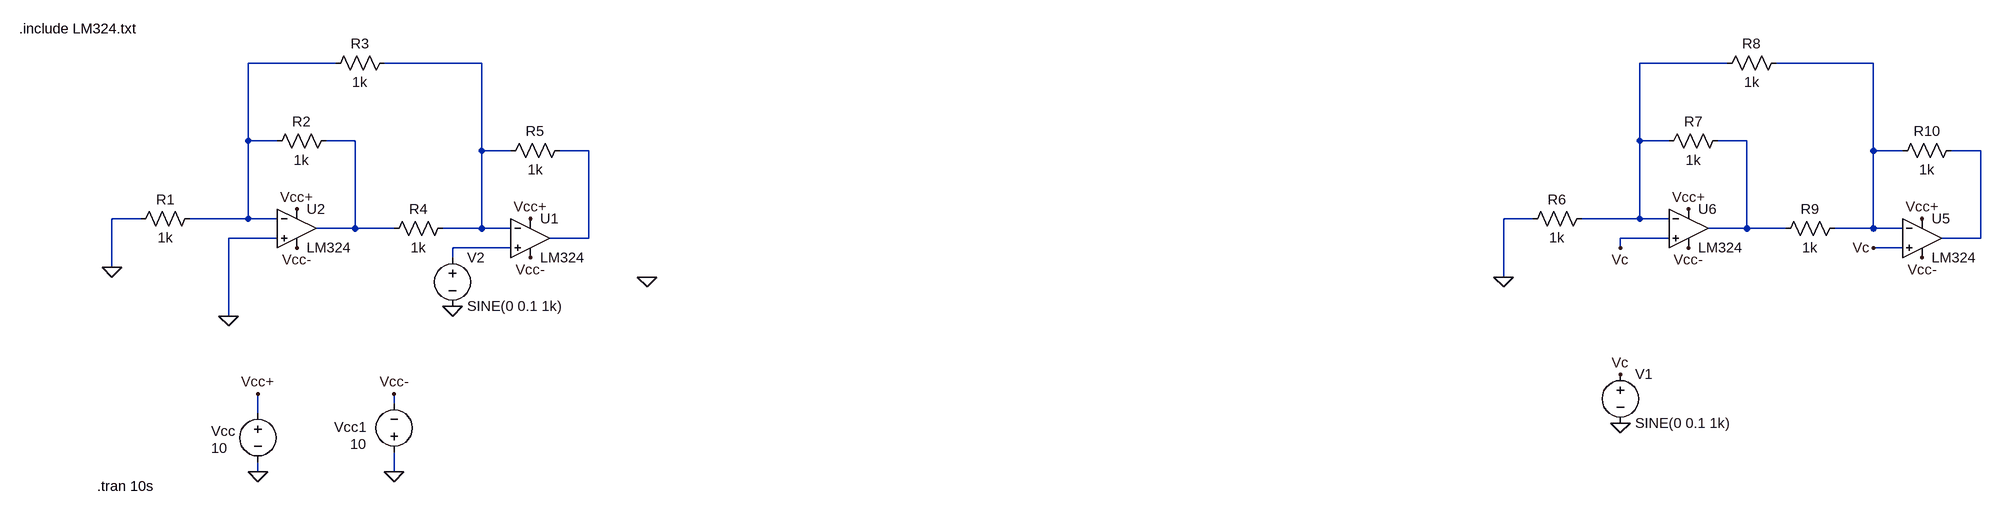
[diagram p0: schematic Circuito_1.asc]
Circuito_1.asc, the LTspice schematic file:
Version 4
SHEET 1 2772 888
WIRE 64 112 -80 112
WIRE 304 112 144 112
WIRE 2352 112 2208 112
WIRE 2592 112 2432 112
WIRE -80 240 -80 112
WIRE -32 240 -80 240
WIRE 96 240 48 240
WIRE 2208 240 2208 112
WIRE 2256 240 2208 240
WIRE 2384 240 2336 240
WIRE 304 256 304 112
WIRE 352 256 304 256
WIRE 480 256 432 256
WIRE 2592 256 2592 112
WIRE 2640 256 2592 256
WIRE 2768 256 2720 256
WIRE -256 368 -304 368
WIRE -80 368 -80 240
WIRE -80 368 -176 368
WIRE -32 368 -80 368
WIRE 2032 368 1984 368
WIRE 2208 368 2208 240
WIRE 2208 368 2112 368
WIRE 2256 368 2208 368
WIRE 96 384 96 240
WIRE 96 384 32 384
WIRE 160 384 96 384
WIRE 304 384 304 256
WIRE 304 384 240 384
WIRE 352 384 304 384
WIRE 2384 384 2384 240
WIRE 2384 384 2320 384
WIRE 2448 384 2384 384
WIRE 2592 384 2592 256
WIRE 2592 384 2528 384
WIRE 2640 384 2592 384
WIRE -32 400 -112 400
WIRE 480 400 480 256
WIRE 480 400 416 400
WIRE 2256 400 2176 400
WIRE 2768 400 2768 256
WIRE 2768 400 2704 400
WIRE 352 416 256 416
WIRE 2176 416 2176 400
WIRE 2640 416 2592 416
WIRE 256 432 256 416
WIRE -304 448 -304 368
WIRE 1984 464 1984 368
WIRE -112 528 -112 400
WIRE 160 672 160 656
WIRE -64 688 -64 656
WIRE -64 784 -64 768
WIRE 160 784 160 752
FLAG -304 448 0
FLAG 576 464 0
FLAG -64 784 0
FLAG -64 656 Vcc+
FLAG 0 352 Vcc+
FLAG 160 656 Vcc-
FLAG 160 784 0
FLAG 0 416 Vcc-
FLAG 384 432 Vcc-
FLAG 384 368 Vcc+
FLAG -112 528 0
FLAG 256 512 0
FLAG 2288 352 Vcc+
FLAG 2288 416 Vcc-
FLAG 2672 432 Vcc-
FLAG 2672 368 Vcc+
FLAG 2176 704 0
FLAG 2176 624 Vc
FLAG 1984 464 0
FLAG 2176 416 Vc
FLAG 2592 416 Vc
DATAFLAG 320 416 "I(V2)"
SYMBOL res -160 352 R90
WINDOW 0 0 56 VBottom 2
WINDOW 3 32 56 VTop 2
SYMATTR InstName R1
SYMATTR Value 1k
SYMBOL res 64 224 R90
WINDOW 0 0 56 VBottom 2
WINDOW 3 32 56 VTop 2
SYMATTR InstName R2
SYMATTR Value 1k
SYMBOL res 48 128 R270
WINDOW 0 32 56 VTop 2
WINDOW 3 0 56 VBottom 2
SYMATTR InstName R3
SYMATTR Value 1k
SYMBOL res 144 400 R270
WINDOW 0 32 56 VTop 2
WINDOW 3 0 56 VBottom 2
SYMATTR InstName R4
SYMATTR Value 1k
SYMBOL res 336 272 R270
WINDOW 0 32 56 VTop 2
WINDOW 3 0 56 VBottom 2
SYMATTR InstName R5
SYMATTR Value 1k
SYMBOL voltage -64 672 R0
WINDOW 0 -77 45 Left 2
WINDOW 3 -77 73 Left 2
WINDOW 123 0 0 Left 0
WINDOW 39 0 0 Left 0
SYMATTR InstName Vcc
SYMATTR Value 10
SYMBOL voltage 160 768 R180
WINDOW 0 45 57 Left 2
WINDOW 3 45 29 Left 2
WINDOW 123 0 0 Left 0
WINDOW 39 0 0 Left 0
SYMATTR InstName Vcc1
SYMATTR Value 10
SYMBOL OpAmps\\opamp2 384 336 R0
SYMATTR InstName U1
SYMATTR Value LM324
SYMBOL OpAmps\\opamp2 0 320 R0
SYMATTR InstName U2
SYMATTR Value LM324
SYMBOL voltage 256 416 R0
WINDOW 123 0 0 Left 0
WINDOW 39 0 0 Left 0
SYMATTR InstName V2
SYMATTR Value SINE(0 0.1 1k)
SYMBOL res 2128 352 R90
WINDOW 0 0 56 VBottom 2
WINDOW 3 32 56 VTop 2
SYMATTR InstName R6
SYMATTR Value 1k
SYMBOL res 2352 224 R90
WINDOW 0 0 56 VBottom 2
WINDOW 3 32 56 VTop 2
SYMATTR InstName R7
SYMATTR Value 1k
SYMBOL res 2336 128 R270
WINDOW 0 32 56 VTop 2
WINDOW 3 0 56 VBottom 2
SYMATTR InstName R8
SYMATTR Value 1k
SYMBOL res 2432 400 R270
WINDOW 0 32 56 VTop 2
WINDOW 3 0 56 VBottom 2
SYMATTR InstName R9
SYMATTR Value 1k
SYMBOL res 2624 272 R270
WINDOW 0 32 56 VTop 2
WINDOW 3 0 56 VBottom 2
SYMATTR InstName R10
SYMATTR Value 1k
SYMBOL OpAmps\\opamp2 2672 336 R0
SYMATTR InstName U5
SYMATTR Value LM324
SYMBOL OpAmps\\opamp2 2288 320 R0
SYMATTR InstName U6
SYMATTR Value LM324
SYMBOL voltage 2176 608 R0
WINDOW 123 0 0 Left 0
WINDOW 39 0 0 Left 0
SYMATTR InstName V1
SYMATTR Value SINE(0 0.1 1k)
TEXT -328 808 Left 2 !.tran 10s
TEXT -456 56 Left 2 !.include LM324.txt

The netlist it stands for:
* Circuito_1.asc
R1 N001 0 1k
R2 N005 N001 1k
R3 N001 N002 1k
R4 N005 N002 1k
R5 N002 N007 1k
Vcc Vcc+ 0 10
Vcc1 0 Vcc- 10
XU1 N009 N002 Vcc+ Vcc- N007 LM324  ; pins In+ In- V+ V- OUT
XU2 0 N001 Vcc+ Vcc- N005 LM324  ; pins In+ In- V+ V- OUT
V2 N009 0 SINE(0 0.1 1k)
R6 N003 0 1k
R7 N006 N003 1k
R8 N003 N004 1k
R9 N006 N004 1k
R10 N004 N008 1k
XU5 Vc N004 Vcc+ Vcc- N008 LM324  ; pins In+ In- V+ V- OUT
XU6 Vc N003 Vcc+ Vcc- N006 LM324  ; pins In+ In- V+ V- OUT
V1 Vc 0 SINE(0 0.1 1k)
.tran 10s
.include LM324.txt
.backanno
.end